# Altium schematic sheet Ballast Motor Control.SchDoc
size A; SheetNumber: 9; SheetTotal: 12
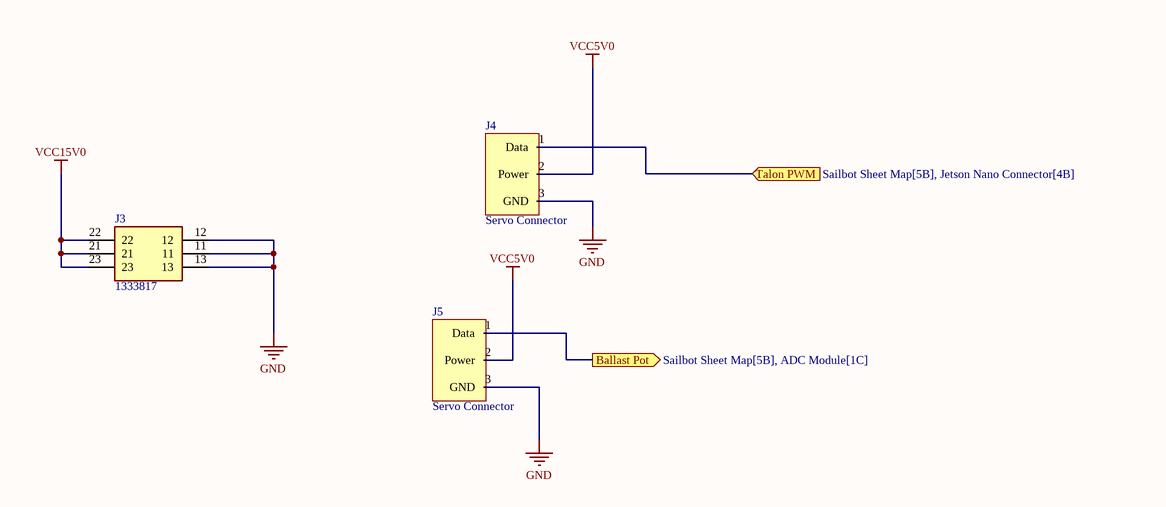
[diagram p0: Ballast Motor Control.SchDoc]

## Parts
J3  1333817  [1333817]
J4  Servo Connector  [3 Pin 0.1in Header]
J5  Servo Connector  [3 Pin 0.1in Header]

## Ports
Ballast Pot (out, see Sailbot Sheet Map[5B], ADC Module[1C]), Talon PWM (in, see Sailbot Sheet Map[5B], Jetson Nano Connector[4B])

## Nets
GND: J3.11 J3.12 J3.13 J4.3(GND) J5.3(GND)
VCC5V0: J4.2(Power) J5.2(Power)
VCC15V0: J3.21 J3.22 J3.23
Ballast Pot: J5.1(Data) ; port Ballast Pot
Talon PWM: J4.1(Data) ; port Talon PWM

## Library data of the parts
J3 = 1333817: Pluggable Terminal Blocks LPTA 16/ 2-10,0-ZB; Manufacturer_Name: Phoenix Contact; Geometry.Height: 46.4mm; Mouser Part Number: 651-1333817; Mouser Price/Stock: https://www.mouser.co.uk/ProductDetail/Phoenix-Contact/1333817?qs=Jm2GQyTW%2Fbi%252BbQzIAqu7ww%3D%3D; Manufacturer_Part_Number: 1333817; Datasheet Link: https://www.phoenixcontact.com/en-pc/products/pcb-terminal-block-lpta-16-2-100-zb-1333817